# EAGLE design dice (EAGLE 8.7.1)
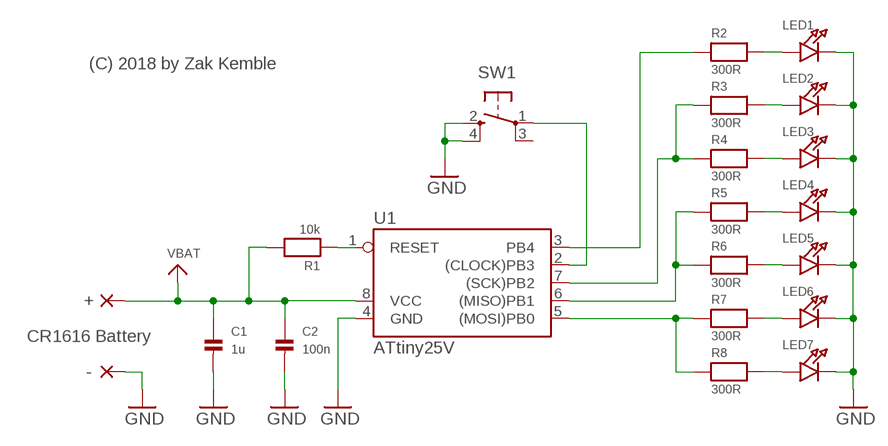
[diagram p0: schematic, sheet 1]

## Parts
C1  1u  CAP_CERAMIC0402  [0402]
C2  100n  CAP_CERAMIC0402  [0402]
LED1  LED0603_NOOUTLINE  [CHIPLED_0603_NOOUTLINE]
LED2  LED0603_NOOUTLINE  [CHIPLED_0603_NOOUTLINE]
LED3  LED0603_NOOUTLINE  [CHIPLED_0603_NOOUTLINE]
LED4  LED0603_NOOUTLINE  [CHIPLED_0603_NOOUTLINE]
LED5  LED0603_NOOUTLINE  [CHIPLED_0603_NOOUTLINE]
LED6  LED0603_NOOUTLINE  [CHIPLED_0603_NOOUTLINE]
LED7  LED0603_NOOUTLINE  [CHIPLED_0603_NOOUTLINE]
PAD1  PADSMD-2X3  [PAD-SMD-2X3]
PAD2  PADSMD-2X3  [PAD-SMD-2X3]
R1  10k  RESISTOR0402  [0402]
R2  300R  RESISTOR0402  [0402]
R3  300R  RESISTOR0402  [0402]
R4  300R  RESISTOR0402  [0402]
R5  300R  RESISTOR0402  [0402]
R6  300R  RESISTOR0402  [0402]
R7  300R  RESISTOR0402  [0402]
R8  300R  RESISTOR0402  [0402]
SW1  SPST_TACTRA  [TACT_SMD2]
U1  ATtiny25V  ATTINY85150MIL_SMPAD  [SOIC8_150MIL_SMPAD]

## Nets
GND: C1.2 C2.2 LED1.C LED2.C LED3.C LED4.C LED5.C LED6.C LED7.C PAD2.1 SW1.2(S) SW1.4(S1) U1.4(GND)
N$2: R1.1 U1.1(RESET)
N$3: R3.1 R4.1 U1.7((SCK)PB2)
N$4: R7.1 R8.1 U1.5((MOSI)PB0)
N$5: R5.1 R6.1 U1.6((MISO)PB1)
N$6: SW1.1(P) U1.2((CLOCK)PB3)
N$7: LED6.A R7.2
N$8: LED7.A R8.2
N$9: R2.1 U1.3(PB4)
N$10: LED4.A R5.2
N$11: LED5.A R6.2
N$12: LED1.A R2.2
N$13: LED3.A R4.2
N$14: LED2.A R3.2
VBAT: C1.1 C2.1 PAD1.1 R1.2 U1.8(VCC)
Unconnected: SW1.3(P1)

## Notes on the sheet
- (C) 2018 by Zak Kemble
- +
- CR1616 Battery
- -

## Library data of the parts
C1 C2 = zak:CAP_CERAMIC
LED1-LED7 = microbuilder:LED: LED 0603 - 0603 Surface Mount Package 2mA: Green LED - Low Power (3.9mcd, 2ma, 1.7Vf) - Digikey: 475-2709-2-ND Orange LED - Low Power (9.8mcd, 2ma, 1.8Vf) - Digikey: 475-1194-2-ND Red LED - Low Power (5mcd, 2ma, 1.8Vf) - Digikey: 475-1195-2-ND Yellow LED - Low Power (7mcd, 2ma, 1.8Vf) - Digikey: 475-1196-2-ND 5mA: Blue LED - Low Power (17mcd, 5ma, 2.9Vf) - Digikey: LNJ937W8CRACT-ND 0805 - 0805 Surface Mount Package 2mA: Red LED (8.8mcd, 2mA, 1.8Vf, Clear) - Low Power [Digikey: 475-2510-1-ND] Green LED (5mcd, 2mA, 1.8Vf, Clear) - Low Power [Digikey: 475-2730-1-ND] Yellow LED (11.3mcd, 2mA, 1.8Vf, Clear) - Low Power [Digikey: 475-2555-1-ND] 20mA: Red LED (104mcd, 20mA, Diffused) - LS R976 [Digikey: 475-1278-6-ND] Red LED (12mcd, 20mA, 2.0Vf, Clear) - APT2012EC [Digikey: 754-1128-1-ND] Green LED (15mcd, 20mA, 2.2Vf, Clear) - APT2012GC [Digikey: 754-1131-1-ND] Orange LED (160mcd, 20mA, 2.1Vf, Clear) - APT2012SECK [Digikey: 754-1130-1-ND] 1206 - 1206 Surface Mount Package Green LED (26mcd, 20mA, Diffused) - LG N971 [Digikey: 475-1407-6-ND] Red LED (15mcd, 20mA, Diffused) - LH N974 [Digikey: 475-1416-6-ND]
PAD1 PAD2 = zak:PAD
R1-R8 = zak:RESISTOR
SW1 = zak:SPST_TACT
U1 = zak:ATTINY85

## Board
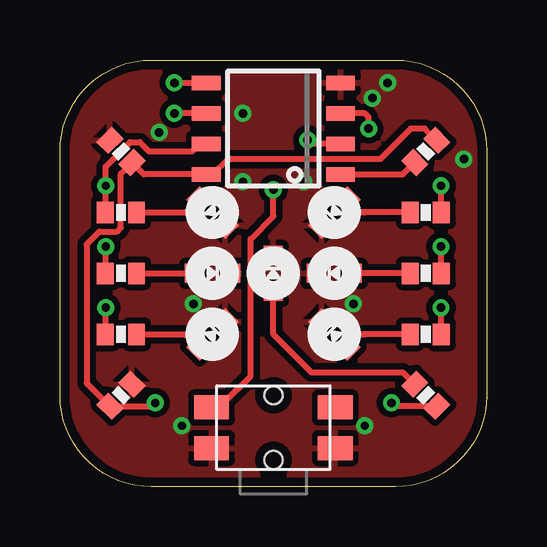
[diagram p1: board, top side]
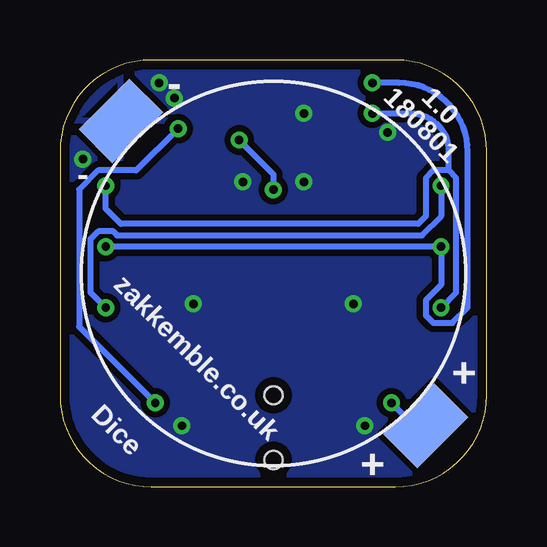
[diagram p2: board, bottom side, seen from below]

Size 17.78 x 17.78 mm. Coordinates in mm from the lower left corner, seen from the top.
Outline: 0,13.97 arc-90 3.81,17.78 13.97,17.78 arc-90 17.78,13.97 17.78,3.81 arc-90 13.97,0 3.81,0 arc-90 0,3.81 0,13.97
Copper layers (1*16): Top 0.0356mm / dielectric 1.5011mm / Bottom 0.0356mm
Design rules "LaenPCBOrder *": minimum track width 6mil, minimum drill 13mil, track to track 6mil, track to pad 6mil, pad to pad 6mil, via to via 6mil, smd to smd 6mil, copper to edge 15mil, drill to drill 6mil, minimum pad ring 12mil, minimum via ring 7mil, stop-mask expansion 4mil, vias tented up to drill 24mil, thermal gap 10mil

### Footprints (pad centres in the part's own frame; a part is rotated, then mirrored left to right if it is on the bottom)
0402 = smd 0.7 x 0.9: 1 -0.65,0; 2 0.65,0
CHIPLED_0603_NOOUTLINE = smd 0.8 x 0.8: A 0,-0.75; C 0,0.75
PAD-SMD-2X3 = smd 2 x 3: 1 0,0
TACT_SMD2 = smd 1.45 x 1: 1 -2.575,-0.5; 2 -2.575,-2.2; 3 2.575,-0.5; 4 2.575,-2.2 | hole 0.75: 0,0; 0,-2.7
SOIC8_150MIL_SMPAD = smd 0.6 x 1.2: 1 -1.905,-2.8; 2 -0.635,-2.8; 3 0.635,-2.8; 4 1.905,-2.8; 5 1.905,2.8; 6 0.635,2.8; 7 -0.635,2.8; 8 -1.905,2.8

### Placement (x,y rotation side)
C1  2.54,3.81 45 top
C2  2.54,13.97 135 top
LED1  8.89,8.89 0 top
LED2  6.35,11.43 225 top
LED3  11.43,6.35 45 top
LED4  6.35,6.35 315 top
LED5  11.43,11.43 135 top
LED6  6.35,8.89 270 top
LED7  11.43,8.89 90 top
PAD1  2.54,2.54 315 bottom
PAD2  15.24,15.24 315 bottom
R1  15.24,13.97 45 top
R2  15.24,3.81 135 top
R3  2.54,11.43 0 top
R4  15.24,6.35 180 top
R5  2.54,6.35 0 top
R6  15.24,11.43 180 top
R7  2.54,8.89 0 top
R8  15.24,8.89 180 top
SW1  8.89,3.81 0 top
U1  8.89,14.92 90 top

### Tracks (layer width: path | path; a pad name or v marks a point on that pad's centre or on a via)
GND  (via drill 0.35)
  other vias: 7.62,15.56 4.13,14.76 13.65,16.83 16.83,13.65 7.62,12.7 10.16,12.7 12.22,7.62 5.56,7.62 12.7,2.54 5.08,2.54 13.02,16.19
  pour Top (isolate 0.254, rank 6): 0,17.78 17.78,17.78 17.78,0 0,0
  pour Bottom (isolate 0.254, rank 6): 17.78,17.78 0,17.78 0,0 17.78,0
N$2
  Top 0.254: U1.1 14.29,13.02 R1.1
N$3  (via drill 0.35)
  Top 0.254: R3.1 1.91,11.45 v1.91,12.54 1.91,13.34 2.92,14.36 3.32,14.36 3.71,13.97 5.5,13.97 5.82,14.29 U1.7 | R4.1 15.88,6.37 v15.88,7.46
  Bottom 0.254: v15.88,7.46 16.51,8.1 16.51,10.32 16.19,10.64 15.56,10.64 15.4,10.48 2.7,10.48 1.91,11.27 v1.91,12.54
N$4  (via drill 0.35)
  Top 0.254: R7.1 1.91,8.9 v1.91,10 | R8.1 15.88,8.9 v15.88,10 | v4.76,16.83 U1.5
  Bottom 0.254: v15.88,10 v1.91,10 1.91,8.41 2.54,7.78 2.54,7.14 2.22,6.83 1.43,6.83 0.79,7.46 0.79,13.97 arc-90 3.65,16.83 v4.76,16.83
N$5  (via drill 0.35)
  Top 0.254: R5.1 1.91,6.37 v1.91,7.46 | R6.1 15.88,11.45 v15.88,12.54 | U1.6 v4.76,15.56
  Bottom 0.254: v1.91,7.46 1.27,8.1 1.27,12.86 1.59,13.18 | 1.59,13.18 2.22,13.18 2.54,12.86 2.54,11.27 2.86,10.95 15.24,10.95 15.88,11.59 v15.88,12.54 | 1.59,13.18 1.59,13.97 arc-90 3.17,15.56 v4.76,15.56
N$6  (via drill 0.35)
  Top 0.254: U1.2 10.48,14.29 v10.32,14.45 | SW1.1 6.5,3.49 6.83,3.49 7.94,4.6 7.94,10.32 8.89,11.27 v8.89,12.38
  Bottom 0.254: v10.32,14.45 8.89,13.02 v8.89,12.38
N$7
  Top 0.254: R7.2 LED6.A
N$8
  Top 0.254: R8.2 LED7.A
N$9  (via drill 0.35)
  Top 0.254: 15.88,3.53 R2.1 13.95,3.35 v13.81,3.49 | v12.86,14.92 12.86,15.4 12.7,15.56 U1.3
  Bottom 0.254: v12.86,14.92 14.61,13.18 16.19,13.18 16.99,12.38 16.99,6.67 v13.81,3.49
N$10
  Top 0.254: R5.2 5.08,6.35 arc-71 LED4.A
N$11
  Top 0.254: R6.2 12.7,11.43 arc-71 LED5.A
N$12
  Top 0.254: LED1.A 8.89,6.35 10.48,4.76 14.29,4.76 R2.2
N$13
  Top 0.254: R4.2 12.7,6.35 arc71 LED3.A
N$14
  Top 0.254: R3.2 5.08,11.43 arc71 LED2.A
VBAT  (via drill 0.35)
  Top 0.254: R1.2 15.21,14.92 14.61,14.92 13.34,13.65 6.99,13.65 6.35,13.02 U1.8 3.49,13.02 C2.1 2.54,13.05 2.54,10.79 2.38,10.63 1.64,10.63 1.11,10.1 1.11,4.32 C1.1 3.83,3.35 v3.97,3.49
  Bottom 0.254: 1.91,3.17 PAD1.1 3.02,2.54 v3.97,3.49

### Text on the board
bPlace: - | 1.0 | 180801 | - | + | zakkemble.co.uk | Dice | +